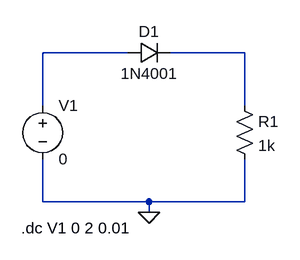
[diagram p0: schematic diodechar_01_02_01_incvs_vd_vr_is.asc]
diodechar_01_02_01_incvs_vd_vr_is.asc, the LTspice schematic file:
Version 4
SHEET 1 880 680
WIRE 112 48 -16 48
WIRE 288 48 176 48
WIRE -16 128 -16 48
WIRE 288 128 288 48
WIRE -16 272 -16 208
WIRE 144 272 -16 272
WIRE 288 272 288 208
WIRE 288 272 144 272
WIRE 144 288 144 272
FLAG 144 288 0
SYMBOL diode 112 64 R270
WINDOW 0 32 32 VTop 2
WINDOW 3 0 32 VBottom 2
SYMATTR InstName D1
SYMATTR Value 1N4001
SYMBOL res 272 112 R0
SYMATTR InstName R1
SYMATTR Value 1k
SYMBOL voltage -16 112 R0
WINDOW 123 0 0 Left 2
WINDOW 39 0 0 Left 2
SYMATTR InstName V1
SYMATTR Value 0
TEXT -48 312 Left 2 !.dc V1 0 2 0.01

The netlist it stands for:
* diodechar_01_02_01_incvs_vd_vr_is.asc
D1 N001 N002 1N4001
R1 N002 0 1k
V1 N001 0 0
.model D D
.lib standard.dio
.dc V1 0 2 0.01
.backanno
.end